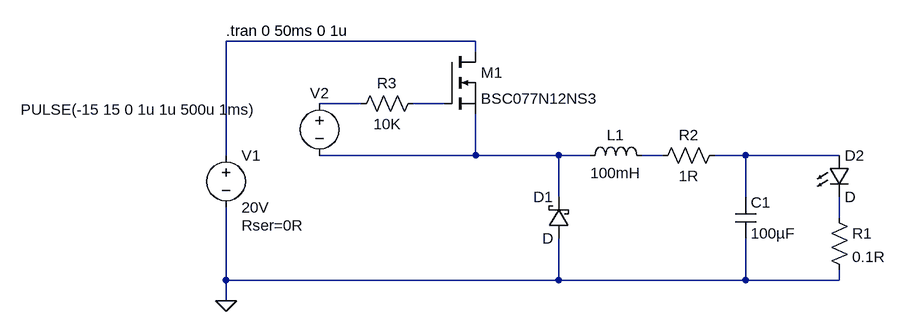
[diagram p0: schematic led_driver_1.asc]
led_driver_1.asc, the LTspice schematic file:
Version 4
SHEET 1 880 680
WIRE 176 -80 -208 -80
WIRE 176 -64 176 -80
WIRE 0 16 -64 16
WIRE 128 16 80 16
WIRE -208 96 -208 -80
WIRE 176 96 176 32
WIRE 176 96 -64 96
WIRE 304 96 176 96
WIRE 352 96 304 96
WIRE 464 96 432 96
WIRE 592 96 544 96
WIRE 736 96 592 96
WIRE 304 160 304 96
WIRE 592 160 592 96
WIRE 736 192 736 160
WIRE -208 288 -208 176
WIRE 304 288 304 224
WIRE 304 288 -208 288
WIRE 592 288 592 224
WIRE 592 288 304 288
WIRE 736 288 736 272
WIRE 736 288 592 288
WIRE -208 320 -208 288
FLAG -208 320 0
SYMBOL voltage -208 80 R0
WINDOW 123 0 0 Left 2
WINDOW 39 24 124 Left 2
SYMATTR InstName V1
SYMATTR Value 20V
SYMATTR SpiceLine Rser=0R
SYMBOL schottky 320 224 R180
WINDOW 0 24 64 Left 2
WINDOW 3 24 0 Left 2
SYMATTR InstName D1
SYMBOL cap 576 160 R0
SYMATTR InstName C1
SYMATTR Value 100µF
SYMBOL ind 336 112 R270
WINDOW 0 32 56 VTop 2
WINDOW 3 5 56 VBottom 2
SYMATTR InstName L1
SYMATTR Value 100mH
SYMBOL res 560 80 R90
WINDOW 0 0 56 VBottom 2
WINDOW 3 32 56 VTop 2
SYMATTR InstName R2
SYMATTR Value 1R
SYMBOL voltage -64 0 R0
WINDOW 0 -15 0 Left 2
WINDOW 3 -460 25 Left 2
WINDOW 123 0 0 Left 2
WINDOW 39 0 0 Left 2
SYMATTR InstName V2
SYMATTR Value PULSE(-15 15 0 1u 1u 500u 1ms)
SYMBOL LED 720 96 R0
SYMATTR InstName D2
SYMBOL res 720 176 R0
SYMATTR InstName R1
SYMATTR Value 0.1R
SYMBOL nmos 128 -64 R0
SYMATTR InstName M1
SYMATTR Value BSC077N12NS3
SYMBOL res 96 0 R90
WINDOW 0 0 56 VBottom 2
WINDOW 3 32 56 VTop 2
SYMATTR InstName R3
SYMATTR Value 10K
TEXT -208 -96 Left 2 !.tran 0 50ms 0 1u

The netlist it stands for:
* led_driver_1.asc
V1 N001 0 20V Rser=0R
D1 0 N004 D
C1 N006 0 100µF
L1 N004 N005 100mH
R2 N006 N005 1R
V2 N002 N004 PULSE(-15 15 0 1u 1u 500u 1ms)
D2 N006 N007 D
R1 N007 0 0.1R
M1 N001 N003 N004 N004 BSC077N12NS3
R3 N003 N002 10K
.model D D
.lib standard.dio
.model NMOS NMOS
.model PMOS PMOS
.lib standard.mos
.tran 0 50ms 0 1u
.backanno
.end